# EasyEDA schematic SCH_Arduino-Train-v.2_2026-08-14.json
TITLE: Arduino Train; REV: 2.0; Date: 2026-08-14; Sheet: 1/1; Drawn By: @avatorl
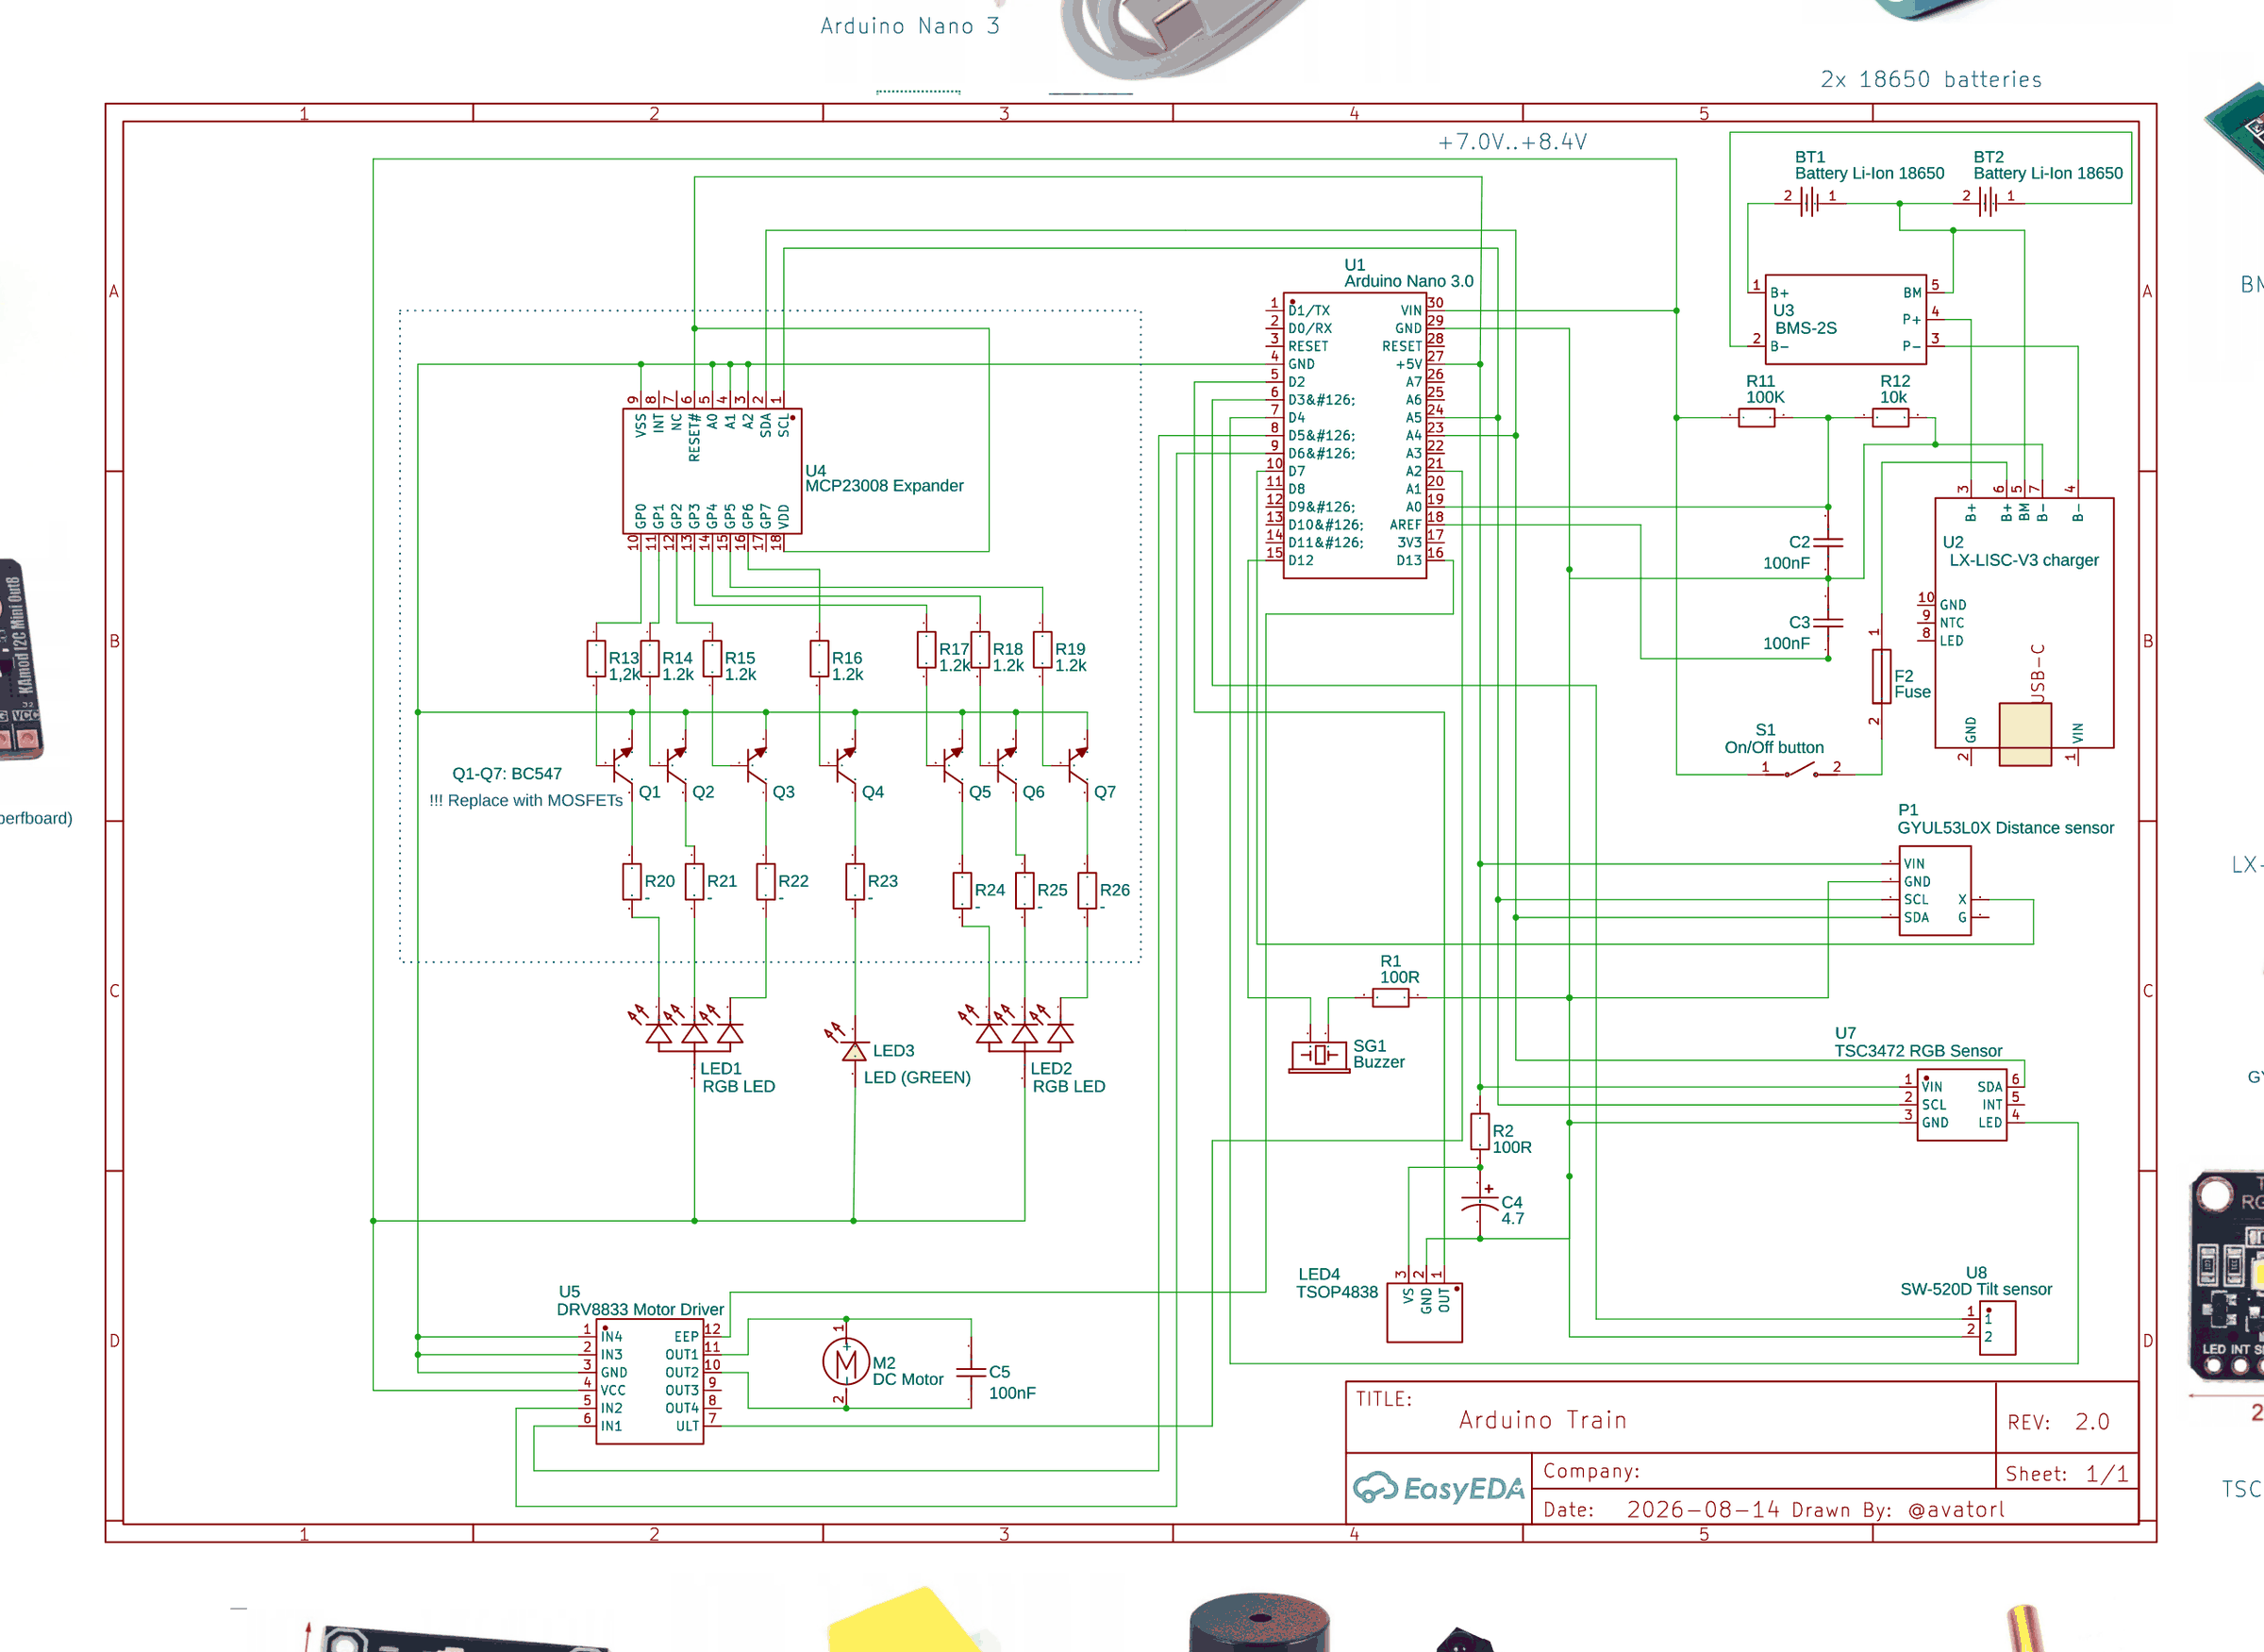
[diagram p0: schematic sheet]

## Parts
BT1  Battery Li-Ion 18650  [BATTERY-SMD_18650-1S-L77.1-W20.7-1]
BT2  Battery Li-Ion 18650  [BATTERY-SMD_18650-1S-L77.1-W20.7-1]
C2  100nF  [CAPACITOR, 2.54MM PIN CAPACITOR]
C3  100nF  [CAPACITOR, 2.54MM PIN CAPACITOR]
C4  4.7  [ELECTROLITIC CAPACITOR 5MM]
C5  100nF  [CAPACITOR, 2.54MM PIN CAPACITOR]
F2  Fuse  [FUSE_BLADE_PCB]
LED1  RGB LED  [LED-SMD_4P-L3.5-W2.8_3528RGB-6028RGB]
LED2  RGB LED  [LED-SMD_4P-L3.5-W2.8_3528RGB-6028RGB]
LED3  LED (GREEN)  [LED-TH_6P_LED4GREEN]
LED4  TSOP4838  [SENSOR-TH_TSOP4X]
M2  DC Motor  [CONN-TH_2P-P5.08]
P1  GYUL53L0X Distance sensor  [FFINAL_IDC-TH_8P-P2.54-V-R2-C4-S2.54]
Q1  Q1-Q7: BC547  [TO-92-3_L4.5-W3.5-P1.27-L]
Q2  BC547  [TO-92-3_L4.5-W3.5-P1.27-L]
Q3  BC547  [TO-92-3_L4.5-W3.5-P1.27-L]
Q4  BC547  [TO-92-3_L4.5-W3.5-P1.27-L]
Q5  BC547  [TO-92-3_L4.5-W3.5-P1.27-L]
Q6  BC547  [TO-92-3_L4.5-W3.5-P1.27-L]
Q7  BC547  [TO-92-3_L4.5-W3.5-P1.27-L]
R1  100R  [R0603]
R2  100R  [R0603]
R11  100K  [R0603]
R12  10k  [R0603]
R13  1,2k  [R0603]
R14  1.2k  [R0603]
R15  1.2k  [R0603]
R16  1.2k  [R0603]
R17  1.2k  [R0603]
R18  1.2k  [R0603]
R19  1.2k  [R0603]
R20  -  [R0603]
R21  -  [R0603]
R22  -  [R0603]
R23  -  [R0603]
R24  -  [R0603]
R25  -  [R0603]
R26  -  [R0603]
S1  On/Off button  [SW-SMD_L3.9-W2.9-LS4.9-L]
SG1  Buzzer  [BUZZER-CMT1102]
U1  Arduino Nano 3.0  [COMM-TH_ARDUINO_NANO]
U2  LX-LISC-V3 charger  [LX-LISC-V1]
U3  BMS-2S  [2S 3A-10A LITHIUM LI-ION 18650 BATTERY BMS PROTECTION PCB BOARD 7.4V/8.4V]
U4  MCP23008 Expander  [PDIP-18_L22.5-W6.6-P2.54-LS7.9-BL]
U5  DRV8833 Motor Driver  [DRV8833]
U7  TSC3472 RGB Sensor  [SENSOR-SMD_TCS34725FN]
U8  SW-520D Tilt sensor  [SENSOR-TH_SW-520D]

## Library data of the parts
BT1 BT2 = BH-18650-B1BA002: Contributor: lcsc; Supplier: LCSC; Supplier Part: C2988620; Manufacturer: MYOUNG(美阳); JLCPCB Part Class: Extended Part
C2 C3 C5 = C_0603_US: Contributor: antonioguadalupe265
C4 = C_Tan_SMD_A_US: Supplier Part: C3810098; Supplier: LCSC; Contributor: ime10; Manufacturer Part: B32672P5105J000; Manufacturer: TDK
F2 = FUSE BLADE_PCB_MOUNT COPY: Contributor: Ahmad riski
LED1 LED2 = 3528RGB 6028RGB: Contributor: lcsc; Supplier: LCSC; Supplier Part: C9900020542; Manufacturer: null; Manufacturer Part: 3528反贴RGB 6028反贴RGB 缺口蓝色; JLCPCB Part Class: Extended Part
LED3 = LED (GREEN): Supplier: LCSC; Supplier Part: C9900027004; Manufacturer: null; Manufacturer Part: LED三色(Red,Yellow,Green); link: https://atta.szlcsc.comnull; Contributor: boumninaotman7
LED4 = TSOP4838: Contributor: LCSC; Supplier: LCSC; Manufacturer: VISHAY(威世); Supplier Part: C124647; JLCPCB Part Class: Extended Part
M2 = Motor_DC: Contributor: KiCAD; license: https://www.gnu.org/licenses/lgpl-2.1.html
P1 = GYUL53L0X_UPDATED final: Supplier: LCSC; Manufacturer: BOOMELE; Manufacturer Part: IDC Box 2X4 2.54MM; image: //image.lceda.cn/szlcsc/C9135.jpg; Supplier Part: C9135; Contributor: cnoofc
Q1-Q7 = BC547: Contributor: LCSC; Supplier: LCSC; Supplier Part: C2910381; Manufacturer: CJ(江苏长电/长晶); Manufacturer Part: BC547(RANGE:420-800); JLCPCB Part Class: Extended Part
R1 R2 R11-R26 = R_0603_EU: Contributor: LCEDA_Lib
S1 = BUTTON: Contributor: lcsc; Supplier: LCSC; Supplier Part: C9900015607; Manufacturer: null; JLCPCB Part Class: Extended Part
SG1 = BUZZER: Contributor: SparkFun
U1 = ARDUINO_NANO: Contributor: lcsc; Supplier: LCSC; Supplier Part: C9900017879; Manufacturer: null; JLCPCB Part Class: Extended Part; Package Display: No
U2 = LX-LISC-V1: Contributor: Citisenx
U3 = 2S 3A-10A Lithium Li-ion 18650 Battery BMS Protection PCB Board 7.4v/8.4V: Manufacturer Part: HX-2S-D01; Contributor: pavlo.turkot
U4 = MCP23008-E/P: Contributor: LCSC; Supplier: LCSC; Supplier Part: C646745; Manufacturer: MICROCHIP(美国微芯); JLCPCB Part Class: Extended Part
U5 = DRV8833 - Motor Driver: Supplier: Add New Supplier; Contributor: Dalibor Drgon
U7 = TCS34725FN: Contributor: LCSC; Supplier: LCSC; Supplier Part: C2649487; Manufacturer: ams(艾迈斯半导体); JLCPCB Part Class: Extended Part
U8 = SW-520D: Supplier: LCSC; Supplier Part: C5379904; Manufacturer: SHOU HAN(首韩); JLCPCB Part Class: Extended Part; Contributor: lcsc

## Nets
Net-(BT1-1): BT1.1 BT2.2 U2.5(BM) U3.5(BM)
Net-(BT1-2): BT1.2 U3.1(B+)
Net-(BT2-1): BT2.1 U3.2(B-)
Net-(C2-1): C2.1 C3.2 C4.2 LED4.2(GND) P1.3(GND) R1.1 R12.2 U1.29(GND) U2.7(B-) U7.3(GND) U8.2
Net-(C2-2): C2.2 R11.2 R12.1 U1.19(A0)
Net-(C3-1): C3.1 U1.18(AREF)
Net-(C4-1): C4.1 LED4.3(VS) R2.2
Net-(C5-1): C5.1 M2.2(-) U5.10(OUT2)
Net-(C5-2): C5.2 M2.1(+) U5.11(OUT1)
Net-(F2-1): F2.1 U2.6(B+)
Net-(F2-2): F2.2 S1.2
Net-(LED1-1): LED1.1(B) R21.2
Net-(LED1-2): LED1.2(R) R22.2
Net-(LED1-3): LED1.3(A) LED2.3(A) LED3.2 R11.1 S1.1 U1.30(VIN) U5.4(VCC)
Net-(LED1-4): LED1.4(G) R20.2
Net-(LED2-1): LED2.1(B) R25.2
Net-(LED2-2): LED2.2(R) R26.2
Net-(LED2-4): LED2.4(G) R24.2
Net-(LED3-1): LED3.1 R23.2
Net-(LED4-1): LED4.1(OUT) U1.5(D2)
Net-(P1-1): P1.1(VIN) R2.1 U1.27(+5V) U4.6(RESET#) U4.18(VDD) U7.1(VIN)
Net-(P1-5): P1.5(SCL) U1.24(A5) U4.1(SCL) U7.2(SCL)
Net-(P1-6): P1.6(X) U1.10(D7)
Net-(P1-7): P1.7(SDA) U1.23(A4) U4.2(SDA) U7.6(SDA)
Net-(Q1-1): Q1.1(C) R20.1
Net-(Q1-2): Q1.2(B) R13.2
Net-(Q1-3): Q1.3(E) Q2.3(E) Q3.3(E) Q4.3(E) Q5.3(E) Q6.3(E) Q7.3(E) U1.4(GND) U4.3(A2) U4.4(A1) U4.5(A0) U4.9(VSS) U5.1(IN4) U5.2(IN3) U5.3(GND)
Net-(Q2-1): Q2.1(C) R21.1
Net-(Q2-2): Q2.2(B) R14.2
Net-(Q3-1): Q3.1(C) R22.1
Net-(Q3-2): Q3.2(B) R15.2
Net-(Q4-1): Q4.1(C) R23.1
Net-(Q4-2): Q4.2(B) R16.2
Net-(Q5-1): Q5.1(C) R24.1
Net-(Q5-2): Q5.2(B) R17.2
Net-(Q6-1): Q6.1(C) R25.1
Net-(Q6-2): Q6.2(B) R18.2
Net-(Q7-1): Q7.1(C) R26.1
Net-(Q7-2): Q7.2(B) R19.2
Net-(R1-2): R1.2 SG1.1
Net-(R13-1): R13.1 U4.10(GP0)
Net-(R14-1): R14.1 U4.11(GP1)
Net-(R15-1): R15.1 U4.12(GP2)
Net-(R16-1): R16.1 U4.16(GP6)
Net-(R17-1): R17.1 U4.13(GP3)
Net-(R18-1): R18.1 U4.14(GP4)
Net-(R19-1): R19.1 U4.15(GP5)
Net-(SG1-2): SG1.2 U1.15(D12)
Net-(U1-6): U1.6(D3&#126;) U8.1
Net-(U1-7): U1.7(D4) U7.4(LED)
Net-(U1-8): U1.8(D5&#126;) U5.6(IN1)
Net-(U1-9): U1.9(D6&#126;) U5.5(IN2)
Net-(U1-16): U1.16(D13) U5.12(EEP)
Net-(U1-21): U1.21(A2) U5.7(ULT)
Net-(U2-3): U2.3(B+) U3.4(P+)
Net-(U2-4): U2.4(B-) U3.3(P-)

Not connected (* = marked no-connect by the designer): P1 8(G); U1 1(D1/TX) 2(D0/RX) 3(RESET) 11(D8) 12(D9&#126;) 13(D10&#126;) 14(D11&#126;) 17(3V3) 20(A1) 22(A3) 25(A6) 26(A7) 28(RESET); U2 1(VIN) 2(GND) 8(LED) 9(NTC) 10(GND); U4 7(NC) 8(INT) 17(GP7); U5 8(OUT4) 9(OUT3); U7 5(INT)

## Notes on the sheet
- Arduino Nano 3
- 2x 18650 batteries
- +7.0V..+8.4V
- BMS-2S
- MCP23008 Expander
- !!! Replace with MOSFETs
- Alternative: MCP23008 Expander with MOSFETs (instead of soldering a perfboard)
- LX-LISC-V3 charger
- GYUL53L0X Distance sensor
- TSC3472 RGB Sensor
- SW-520D Tilt Sensor
- Buzzer
- TSOP4838 IR Sensor
- DRV8833 Motor Driver
- 3-6V DC Motor 1:48
